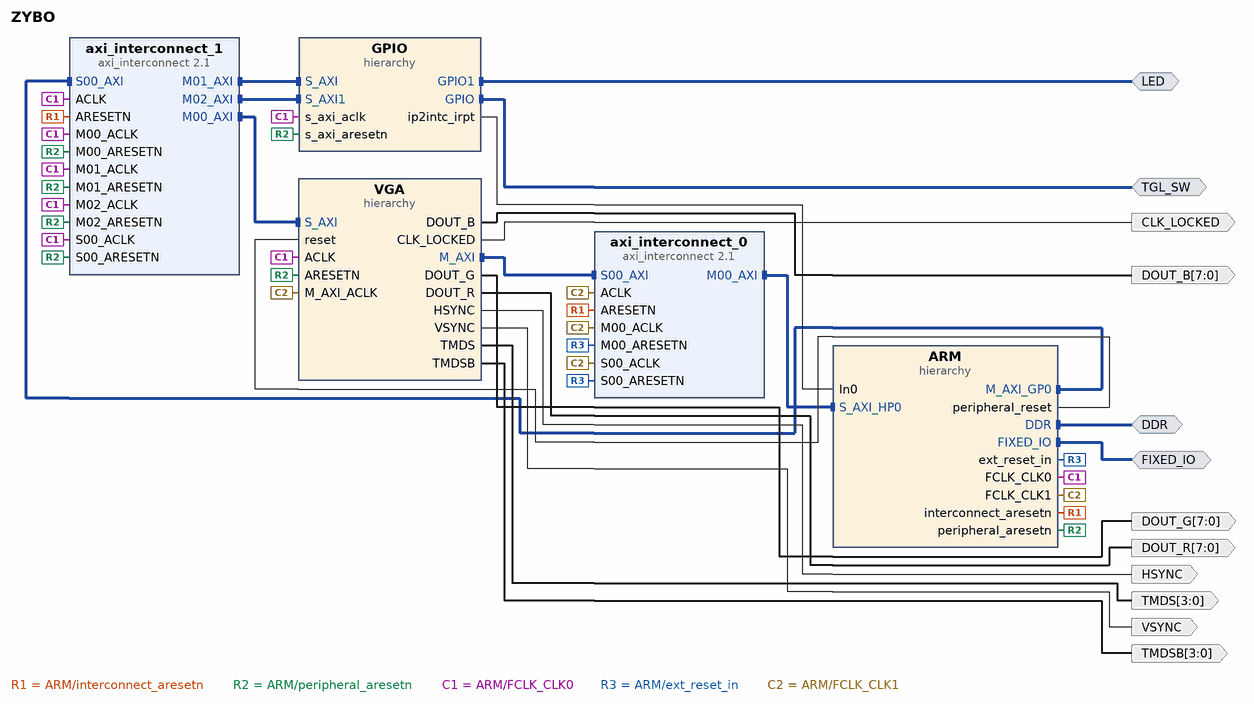
[diagram p0: block diagram of the top level]
# Vivado block design ZYBO, Vivado 2015.4
create_bd_design ZYBO

create_bd_intf_port -mode Master -vlnv xilinx.com:interface:ddrx_rtl:1.0 DDR
create_bd_intf_port -mode Master -vlnv xilinx.com:display_processing_system7:fixedio_rtl:1.0 FIXED_IO
create_bd_intf_port -mode Master -vlnv xilinx.com:interface:gpio_rtl:1.0 LED
create_bd_intf_port -mode Master -vlnv xilinx.com:interface:gpio_rtl:1.0 TGL_SW
create_bd_port -dir O -from 7 -to 0 DOUT_B
create_bd_port -dir O -from 7 -to 0 DOUT_G
create_bd_port -dir O -from 7 -to 0 DOUT_R
create_bd_port -dir O HSYNC
create_bd_port -dir O VSYNC
create_bd_port -dir O CLK_LOCKED
create_bd_port -dir O -from 3 -to 0 TMDS
create_bd_port -dir O -from 3 -to 0 TMDSB

create_bd_cell -type hier ARM
create_bd_cell -type hier GPIO
create_bd_cell -type hier VGA
create_bd_cell -type ip -vlnv xilinx.com:ip:axi_interconnect:2.1 axi_interconnect_0
set_property -dict {CONFIG.NUM_MI 1} [get_bd_cells axi_interconnect_0]
create_bd_cell -type ip -vlnv xilinx.com:ip:axi_interconnect:2.1 axi_interconnect_1
set_property -dict {CONFIG.NUM_MI 3} [get_bd_cells axi_interconnect_1]

# ---- hierarchy /ARM ----
current_bd_instance /ARM
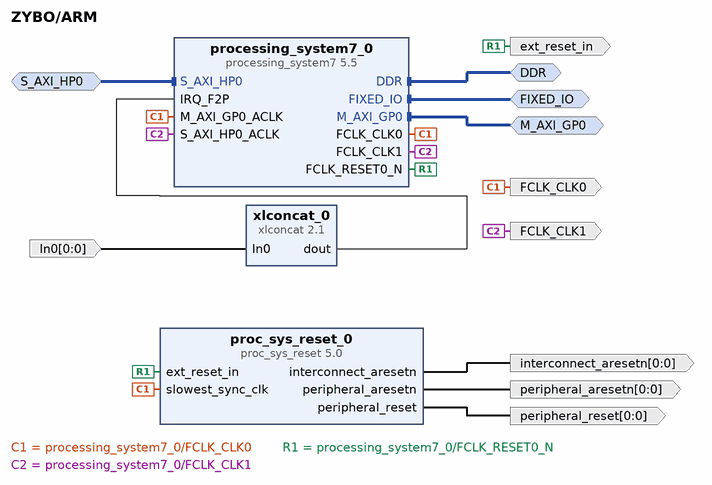
[diagram p1: block diagram inside /ARM]
create_bd_intf_pin -mode Master -vlnv xilinx.com:interface:ddrx_rtl:1.0 DDR
create_bd_intf_pin -mode Master -vlnv xilinx.com:display_processing_system7:fixedio_rtl:1.0 FIXED_IO
create_bd_intf_pin -mode Master -vlnv xilinx.com:interface:aximm_rtl:1.0 M_AXI_GP0
create_bd_intf_pin -mode Slave -vlnv xilinx.com:interface:aximm_rtl:1.0 S_AXI_HP0
create_bd_pin -dir O -type clk FCLK_CLK0
create_bd_pin -dir I -from 0 -to 0 In0
create_bd_pin -dir O -type rst ext_reset_in
create_bd_pin -dir O -from 0 -to 0 -type rst interconnect_aresetn
create_bd_pin -dir O -from 0 -to 0 -type rst peripheral_aresetn
create_bd_pin -dir O -from 0 -to 0 -type rst peripheral_reset
create_bd_pin -dir O -type clk FCLK_CLK1

create_bd_cell -type ip -vlnv xilinx.com:ip:proc_sys_reset:5.0 proc_sys_reset_0
create_bd_cell -type ip -vlnv xilinx.com:ip:processing_system7:5.5 processing_system7_0
set_property -dict [list \
  CONFIG.PCW_FPGA0_PERIPHERAL_FREQMHZ 100 \
  CONFIG.PCW_FPGA1_PERIPHERAL_FREQMHZ 150 \
  CONFIG.PCW_USE_S_AXI_HP0 1 \
  CONFIG.PCW_USE_FABRIC_INTERRUPT 1 \
  CONFIG.PCW_EN_CLK1_PORT 1 \
  CONFIG.PCW_IRQ_F2P_INTR 1 \
  CONFIG.PCW_IMPORT_BOARD_PRESET /home/hidemi/workspace/ZYBO/ZYBO_zynq_def.xml \
  CONFIG.PCW_QSPI_GRP_SINGLE_SS_ENABLE 1 \
  CONFIG.PCW_SD0_GRP_WP_ENABLE 0 \
  CONFIG.PCW_USB0_RESET_ENABLE 1 \
  CONFIG.PCW_USB0_RESET_IO {MIO 46} \
  CONFIG.PCW_GPIO_MIO_GPIO_ENABLE 1 \
  CONFIG.PCW_GPIO_MIO_GPIO_IO MIO \
  CONFIG.PCW_FCLK1_PERIPHERAL_CLKSRC {DDR PLL} \
  CONFIG.PCW_UIPARAM_GENERATE_SUMMARY NONE \
] [get_bd_cells processing_system7_0]
# 2 more settings of processing_system7_0 are not shown: defaults, MIO pin electricals, DDR timing, and values the tool derives
create_bd_cell -type ip -vlnv xilinx.com:ip:xlconcat:2.1 xlconcat_0
set_property -dict {CONFIG.NUM_PORTS 1} [get_bd_cells xlconcat_0]

# ---- hierarchy /GPIO ----
current_bd_instance /GPIO
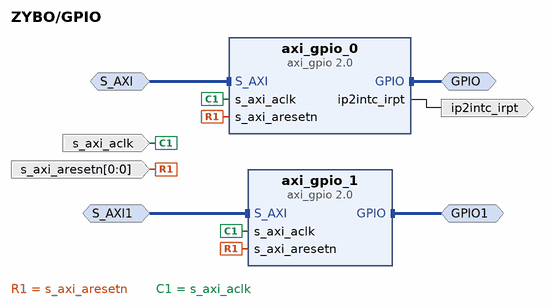
[diagram p2: block diagram inside /GPIO]
create_bd_intf_pin -mode Master -vlnv xilinx.com:interface:gpio_rtl:1.0 GPIO
create_bd_intf_pin -mode Master -vlnv xilinx.com:interface:gpio_rtl:1.0 GPIO1
create_bd_intf_pin -mode Slave -vlnv xilinx.com:interface:aximm_rtl:1.0 S_AXI
create_bd_intf_pin -mode Slave -vlnv xilinx.com:interface:aximm_rtl:1.0 S_AXI1
create_bd_pin -dir O -type intr ip2intc_irpt
create_bd_pin -dir I -type clk s_axi_aclk
create_bd_pin -dir I -from 0 -to 0 -type rst s_axi_aresetn

create_bd_cell -type ip -vlnv xilinx.com:ip:axi_gpio:2.0 axi_gpio_0
set_property -dict {CONFIG.C_GPIO_WIDTH 4 CONFIG.C_ALL_INPUTS 1 CONFIG.C_INTERRUPT_PRESENT 1} [get_bd_cells axi_gpio_0]
create_bd_cell -type ip -vlnv xilinx.com:ip:axi_gpio:2.0 axi_gpio_1
set_property -dict {CONFIG.C_GPIO_WIDTH 4 CONFIG.C_ALL_INPUTS 0 CONFIG.C_ALL_OUTPUTS 1} [get_bd_cells axi_gpio_1]

# ---- hierarchy /VGA ----
current_bd_instance /VGA
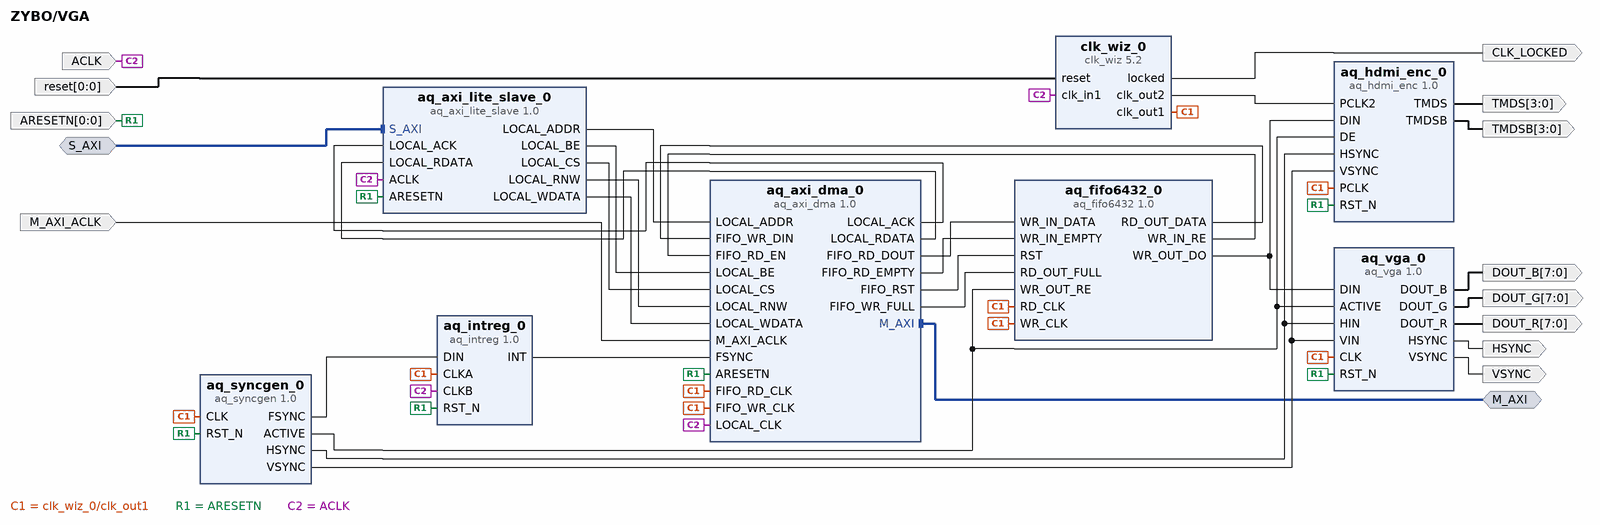
[diagram p3: block diagram inside /VGA]
create_bd_intf_pin -mode Master -vlnv xilinx.com:interface:aximm_rtl:1.0 M_AXI
create_bd_intf_pin -mode Slave -vlnv xilinx.com:interface:aximm_rtl:1.0 S_AXI
create_bd_pin -dir I -type clk ACLK
create_bd_pin -dir I -from 0 -to 0 -type rst ARESETN
create_bd_pin -dir O -from 7 -to 0 DOUT_B
create_bd_pin -dir O -from 7 -to 0 DOUT_G
create_bd_pin -dir O -from 7 -to 0 DOUT_R
create_bd_pin -dir O HSYNC
create_bd_pin -dir O VSYNC
create_bd_pin -dir I -from 0 -to 0 -type rst reset
create_bd_pin -dir O CLK_LOCKED
create_bd_pin -dir O -from 3 -to 0 TMDS
create_bd_pin -dir O -from 3 -to 0 TMDSB
create_bd_pin -dir I -type clk M_AXI_ACLK

create_bd_cell -type ip -vlnv user.org:user:aq_axi_dma:1.0 aq_axi_dma_0
create_bd_cell -type ip -vlnv user.org:user:aq_axi_lite_slave:1.0 aq_axi_lite_slave_0
create_bd_cell -type ip -vlnv user.org:user:aq_fifo6432:1.0 aq_fifo6432_0
create_bd_cell -type ip -vlnv user.org:user:aq_intreg:1.0 aq_intreg_0
create_bd_cell -type ip -vlnv xilinx.com:ip:clk_wiz:5.2 clk_wiz_0
set_property -dict [list \
  CONFIG.PRIM_IN_FREQ 100 \
  CONFIG.CLKIN1_JITTER_PS 100.0 \
  CONFIG.CLKOUT2_USED true \
  CONFIG.NUM_OUT_CLKS 2 \
  CONFIG.CLKOUT1_REQUESTED_OUT_FREQ 65 \
  CONFIG.CLKOUT2_REQUESTED_OUT_FREQ 375 \
  CONFIG.MMCM_DIVCLK_DIVIDE 5 \
  CONFIG.MMCM_CLKFBOUT_MULT_F 37.375 \
  CONFIG.MMCM_CLKIN1_PERIOD 10.0 \
  CONFIG.MMCM_CLKOUT0_DIVIDE_F 11.500 \
  CONFIG.MMCM_CLKOUT1_DIVIDE 2 \
  CONFIG.CLKOUT1_JITTER 343.397 \
  CONFIG.CLKOUT1_PHASE_ERROR 320.324 \
  CONFIG.CLKOUT2_JITTER 256.032 \
  CONFIG.CLKOUT2_PHASE_ERROR 320.324 \
] [get_bd_cells clk_wiz_0]
create_bd_cell -type ip -vlnv user.org:user:aq_vga:1.0 aq_vga_0
create_bd_cell -type ip -vlnv user.org:user:aq_hdmi_enc:1.0 aq_hdmi_enc_0
create_bd_cell -type ip -vlnv user.org:user:aq_syncgen:1.0 aq_syncgen_0

# ---- connections ----

current_bd_instance /ARM
connect_bd_intf_net [get_bd_intf_pins DDR] [get_bd_intf_pins processing_system7_0/DDR]
connect_bd_intf_net [get_bd_intf_pins FIXED_IO] [get_bd_intf_pins processing_system7_0/FIXED_IO]
connect_bd_intf_net [get_bd_intf_pins M_AXI_GP0] [get_bd_intf_pins processing_system7_0/M_AXI_GP0]
connect_bd_intf_net -intf_net axi_interconnect_0_M00_AXI [get_bd_intf_pins S_AXI_HP0] [get_bd_intf_pins processing_system7_0/S_AXI_HP0]
connect_bd_net -net axi_gpio_0_ip2intc_irpt [get_bd_pins In0] [get_bd_pins xlconcat_0/In0]
connect_bd_net [get_bd_pins proc_sys_reset_0/interconnect_aresetn] [get_bd_pins interconnect_aresetn]
connect_bd_net [get_bd_pins proc_sys_reset_0/peripheral_aresetn] [get_bd_pins peripheral_aresetn]
connect_bd_net [get_bd_pins proc_sys_reset_0/peripheral_reset] [get_bd_pins peripheral_reset]
connect_bd_net [get_bd_pins processing_system7_0/FCLK_CLK0] \
  [get_bd_pins FCLK_CLK0] [get_bd_pins proc_sys_reset_0/slowest_sync_clk] [get_bd_pins processing_system7_0/M_AXI_GP0_ACLK]
connect_bd_net [get_bd_pins processing_system7_0/FCLK_RESET0_N] [get_bd_pins ext_reset_in] [get_bd_pins proc_sys_reset_0/ext_reset_in]
connect_bd_net [get_bd_pins xlconcat_0/dout] [get_bd_pins processing_system7_0/IRQ_F2P]
connect_bd_net [get_bd_pins processing_system7_0/FCLK_CLK1] [get_bd_pins FCLK_CLK1] [get_bd_pins processing_system7_0/S_AXI_HP0_ACLK]

current_bd_instance /GPIO
connect_bd_intf_net [get_bd_intf_pins GPIO] [get_bd_intf_pins axi_gpio_0/GPIO]
connect_bd_intf_net [get_bd_intf_pins GPIO1] [get_bd_intf_pins axi_gpio_1/GPIO]
connect_bd_intf_net -intf_net axi_interconnect_1_M01_AXI [get_bd_intf_pins S_AXI] [get_bd_intf_pins axi_gpio_0/S_AXI]
connect_bd_intf_net -intf_net axi_interconnect_1_M02_AXI [get_bd_intf_pins S_AXI1] [get_bd_intf_pins axi_gpio_1/S_AXI]
connect_bd_net [get_bd_pins axi_gpio_0/ip2intc_irpt] [get_bd_pins ip2intc_irpt]
connect_bd_net -net proc_sys_reset_0_peripheral_aresetn [get_bd_pins s_axi_aresetn] \
  [get_bd_pins axi_gpio_0/s_axi_aresetn] [get_bd_pins axi_gpio_1/s_axi_aresetn]
connect_bd_net -net processing_system7_0_FCLK_CLK0 [get_bd_pins s_axi_aclk] [get_bd_pins axi_gpio_0/s_axi_aclk] [get_bd_pins axi_gpio_1/s_axi_aclk]

current_bd_instance /VGA
connect_bd_intf_net [get_bd_intf_pins M_AXI] [get_bd_intf_pins aq_axi_dma_0/M_AXI]
connect_bd_intf_net -intf_net axi_interconnect_1_M00_AXI [get_bd_intf_pins S_AXI] [get_bd_intf_pins aq_axi_lite_slave_0/S_AXI]
connect_bd_net [get_bd_pins aq_axi_dma_0/FIFO_RD_DOUT] [get_bd_pins aq_fifo6432_0/WR_IN_DATA]
connect_bd_net [get_bd_pins aq_axi_dma_0/FIFO_RD_EMPTY] [get_bd_pins aq_fifo6432_0/WR_IN_EMPTY]
connect_bd_net [get_bd_pins aq_axi_dma_0/FIFO_RST] [get_bd_pins aq_fifo6432_0/RST]
connect_bd_net [get_bd_pins aq_axi_dma_0/FIFO_WR_FULL] [get_bd_pins aq_fifo6432_0/RD_OUT_FULL]
connect_bd_net [get_bd_pins aq_axi_dma_0/LOCAL_ACK] [get_bd_pins aq_axi_lite_slave_0/LOCAL_ACK]
connect_bd_net [get_bd_pins aq_axi_dma_0/LOCAL_RDATA] [get_bd_pins aq_axi_lite_slave_0/LOCAL_RDATA]
connect_bd_net [get_bd_pins aq_axi_lite_slave_0/LOCAL_ADDR] [get_bd_pins aq_axi_dma_0/LOCAL_ADDR]
connect_bd_net [get_bd_pins aq_axi_lite_slave_0/LOCAL_BE] [get_bd_pins aq_axi_dma_0/LOCAL_BE]
connect_bd_net [get_bd_pins aq_axi_lite_slave_0/LOCAL_CS] [get_bd_pins aq_axi_dma_0/LOCAL_CS]
connect_bd_net [get_bd_pins aq_axi_lite_slave_0/LOCAL_RNW] [get_bd_pins aq_axi_dma_0/LOCAL_RNW]
connect_bd_net [get_bd_pins aq_axi_lite_slave_0/LOCAL_WDATA] [get_bd_pins aq_axi_dma_0/LOCAL_WDATA]
connect_bd_net [get_bd_pins aq_fifo6432_0/RD_OUT_DATA] [get_bd_pins aq_axi_dma_0/FIFO_WR_DIN]
connect_bd_net [get_bd_pins aq_fifo6432_0/WR_IN_RE] [get_bd_pins aq_axi_dma_0/FIFO_RD_EN]
connect_bd_net [get_bd_pins aq_fifo6432_0/WR_OUT_DO] [get_bd_pins aq_vga_0/DIN] [get_bd_pins aq_hdmi_enc_0/DIN]
connect_bd_net [get_bd_pins aq_intreg_0/INT] [get_bd_pins aq_axi_dma_0/FSYNC]
connect_bd_net [get_bd_pins aq_syncgen_0/ACTIVE] [get_bd_pins aq_fifo6432_0/WR_OUT_RE] [get_bd_pins aq_vga_0/ACTIVE] [get_bd_pins aq_hdmi_enc_0/DE]
connect_bd_net [get_bd_pins aq_syncgen_0/FSYNC] [get_bd_pins aq_intreg_0/DIN]
connect_bd_net [get_bd_pins aq_syncgen_0/HSYNC] [get_bd_pins aq_vga_0/HIN] [get_bd_pins aq_hdmi_enc_0/HSYNC]
connect_bd_net [get_bd_pins aq_syncgen_0/VSYNC] [get_bd_pins aq_vga_0/VIN] [get_bd_pins aq_hdmi_enc_0/VSYNC]
connect_bd_net [get_bd_pins aq_vga_0/DOUT_B] [get_bd_pins DOUT_B]
connect_bd_net [get_bd_pins aq_vga_0/DOUT_G] [get_bd_pins DOUT_G]
connect_bd_net [get_bd_pins aq_vga_0/DOUT_R] [get_bd_pins DOUT_R]
connect_bd_net [get_bd_pins aq_vga_0/HSYNC] [get_bd_pins HSYNC]
connect_bd_net [get_bd_pins aq_vga_0/VSYNC] [get_bd_pins VSYNC]
connect_bd_net [get_bd_pins clk_wiz_0/clk_out1] \
  [get_bd_pins aq_axi_dma_0/FIFO_RD_CLK] [get_bd_pins aq_axi_dma_0/FIFO_WR_CLK] [get_bd_pins aq_fifo6432_0/RD_CLK] \
  [get_bd_pins aq_fifo6432_0/WR_CLK] [get_bd_pins aq_vga_0/CLK] [get_bd_pins aq_intreg_0/CLKA] \
  [get_bd_pins aq_hdmi_enc_0/PCLK] [get_bd_pins aq_syncgen_0/CLK]
connect_bd_net -net proc_sys_reset_0_peripheral_aresetn [get_bd_pins ARESETN] \
  [get_bd_pins aq_axi_dma_0/ARESETN] [get_bd_pins aq_axi_lite_slave_0/ARESETN] [get_bd_pins aq_intreg_0/RST_N] \
  [get_bd_pins aq_vga_0/RST_N] [get_bd_pins aq_hdmi_enc_0/RST_N] [get_bd_pins aq_syncgen_0/RST_N]
connect_bd_net -net proc_sys_reset_0_peripheral_reset [get_bd_pins reset] [get_bd_pins clk_wiz_0/reset]
connect_bd_net -net processing_system7_0_FCLK_CLK0 [get_bd_pins ACLK] \
  [get_bd_pins aq_axi_dma_0/LOCAL_CLK] [get_bd_pins aq_axi_lite_slave_0/ACLK] [get_bd_pins aq_intreg_0/CLKB] \
  [get_bd_pins clk_wiz_0/clk_in1]
connect_bd_net [get_bd_pins clk_wiz_0/locked] [get_bd_pins CLK_LOCKED]
connect_bd_net [get_bd_pins aq_hdmi_enc_0/TMDS] [get_bd_pins TMDS]
connect_bd_net [get_bd_pins aq_hdmi_enc_0/TMDSB] [get_bd_pins TMDSB]
connect_bd_net [get_bd_pins clk_wiz_0/clk_out2] [get_bd_pins aq_hdmi_enc_0/PCLK2]
connect_bd_net [get_bd_pins M_AXI_ACLK] [get_bd_pins aq_axi_dma_0/M_AXI_ACLK]

current_bd_instance /
connect_bd_intf_net -intf_net aq_axi_dma_0_M_AXI [get_bd_intf_pins VGA/M_AXI] [get_bd_intf_pins axi_interconnect_0/S00_AXI]
connect_bd_intf_net [get_bd_intf_pins ARM/S_AXI_HP0] [get_bd_intf_pins axi_interconnect_0/M00_AXI]
connect_bd_intf_net [get_bd_intf_pins VGA/S_AXI] [get_bd_intf_pins axi_interconnect_1/M00_AXI]
connect_bd_intf_net [get_bd_intf_pins GPIO/S_AXI] [get_bd_intf_pins axi_interconnect_1/M01_AXI]
connect_bd_intf_net [get_bd_intf_pins GPIO/S_AXI1] [get_bd_intf_pins axi_interconnect_1/M02_AXI]
connect_bd_intf_net -intf_net processing_system7_0_M_AXI_GP0 [get_bd_intf_pins ARM/M_AXI_GP0] [get_bd_intf_pins axi_interconnect_1/S00_AXI]
connect_bd_intf_net -intf_net processing_system7_0_DDR [get_bd_intf_ports DDR] [get_bd_intf_pins ARM/DDR]
connect_bd_intf_net -intf_net processing_system7_0_FIXED_IO [get_bd_intf_ports FIXED_IO] [get_bd_intf_pins ARM/FIXED_IO]
connect_bd_intf_net -intf_net axi_gpio_1_GPIO [get_bd_intf_ports LED] [get_bd_intf_pins GPIO/GPIO1]
connect_bd_intf_net -intf_net axi_gpio_0_GPIO [get_bd_intf_ports TGL_SW] [get_bd_intf_pins GPIO/GPIO]
connect_bd_net -net aq_vga_0_DOUT_B [get_bd_pins VGA/DOUT_B] [get_bd_ports DOUT_B]
connect_bd_net -net aq_vga_0_DOUT_G [get_bd_pins VGA/DOUT_G] [get_bd_ports DOUT_G]
connect_bd_net -net aq_vga_0_DOUT_R [get_bd_pins VGA/DOUT_R] [get_bd_ports DOUT_R]
connect_bd_net -net aq_vga_0_HSYNC [get_bd_pins VGA/HSYNC] [get_bd_ports HSYNC]
connect_bd_net -net aq_vga_0_VSYNC [get_bd_pins VGA/VSYNC] [get_bd_ports VSYNC]
connect_bd_net -net axi_gpio_0_ip2intc_irpt [get_bd_pins GPIO/ip2intc_irpt] [get_bd_pins ARM/In0]
connect_bd_net -net proc_sys_reset_0_interconnect_aresetn [get_bd_pins ARM/interconnect_aresetn] \
  [get_bd_pins axi_interconnect_0/ARESETN] [get_bd_pins axi_interconnect_1/ARESETN]
connect_bd_net -net proc_sys_reset_0_peripheral_aresetn [get_bd_pins ARM/peripheral_aresetn] \
  [get_bd_pins GPIO/s_axi_aresetn] [get_bd_pins VGA/ARESETN] [get_bd_pins axi_interconnect_1/M00_ARESETN] \
  [get_bd_pins axi_interconnect_1/M01_ARESETN] [get_bd_pins axi_interconnect_1/M02_ARESETN] \
  [get_bd_pins axi_interconnect_1/S00_ARESETN]
connect_bd_net -net proc_sys_reset_0_peripheral_reset [get_bd_pins ARM/peripheral_reset] [get_bd_pins VGA/reset]
connect_bd_net -net processing_system7_0_FCLK_CLK0 [get_bd_pins ARM/FCLK_CLK0] \
  [get_bd_pins GPIO/s_axi_aclk] [get_bd_pins VGA/ACLK] [get_bd_pins axi_interconnect_1/ACLK] \
  [get_bd_pins axi_interconnect_1/M00_ACLK] [get_bd_pins axi_interconnect_1/M01_ACLK] \
  [get_bd_pins axi_interconnect_1/M02_ACLK] [get_bd_pins axi_interconnect_1/S00_ACLK]
connect_bd_net -net processing_system7_0_FCLK_RESET0_N [get_bd_pins ARM/ext_reset_in] \
  [get_bd_pins axi_interconnect_0/M00_ARESETN] [get_bd_pins axi_interconnect_0/S00_ARESETN]
connect_bd_net -net VGA_locked [get_bd_pins VGA/CLK_LOCKED] [get_bd_ports CLK_LOCKED]
connect_bd_net [get_bd_pins VGA/TMDS] [get_bd_ports TMDS]
connect_bd_net [get_bd_pins VGA/TMDSB] [get_bd_ports TMDSB]
connect_bd_net -net M00_ACLK_1 [get_bd_pins ARM/FCLK_CLK1] \
  [get_bd_pins axi_interconnect_0/M00_ACLK] [get_bd_pins axi_interconnect_0/S00_ACLK] [get_bd_pins axi_interconnect_0/ACLK] \
  [get_bd_pins VGA/M_AXI_ACLK]

# ---- address map ----
assign_bd_address -offset 0x40000000 -range 64K -target_address_space [get_bd_addr_spaces ARM/processing_system7_0/Data] [get_bd_addr_segs VGA/aq_axi_lite_slave_0/S_AXI/reg0]
assign_bd_address -offset 0x40010000 -range 64K -target_address_space [get_bd_addr_spaces ARM/processing_system7_0/Data] [get_bd_addr_segs GPIO/axi_gpio_0/S_AXI/Reg]
assign_bd_address -offset 0x40020000 -range 64K -target_address_space [get_bd_addr_spaces ARM/processing_system7_0/Data] [get_bd_addr_segs GPIO/axi_gpio_1/S_AXI/Reg]
assign_bd_address -offset 0x00000000 -range 512M -target_address_space [get_bd_addr_spaces VGA/aq_axi_dma_0/M_AXI] [get_bd_addr_segs ARM/processing_system7_0/S_AXI_HP0/HP0_DDR_LOWOCM]

validate_bd_design
save_bd_design
